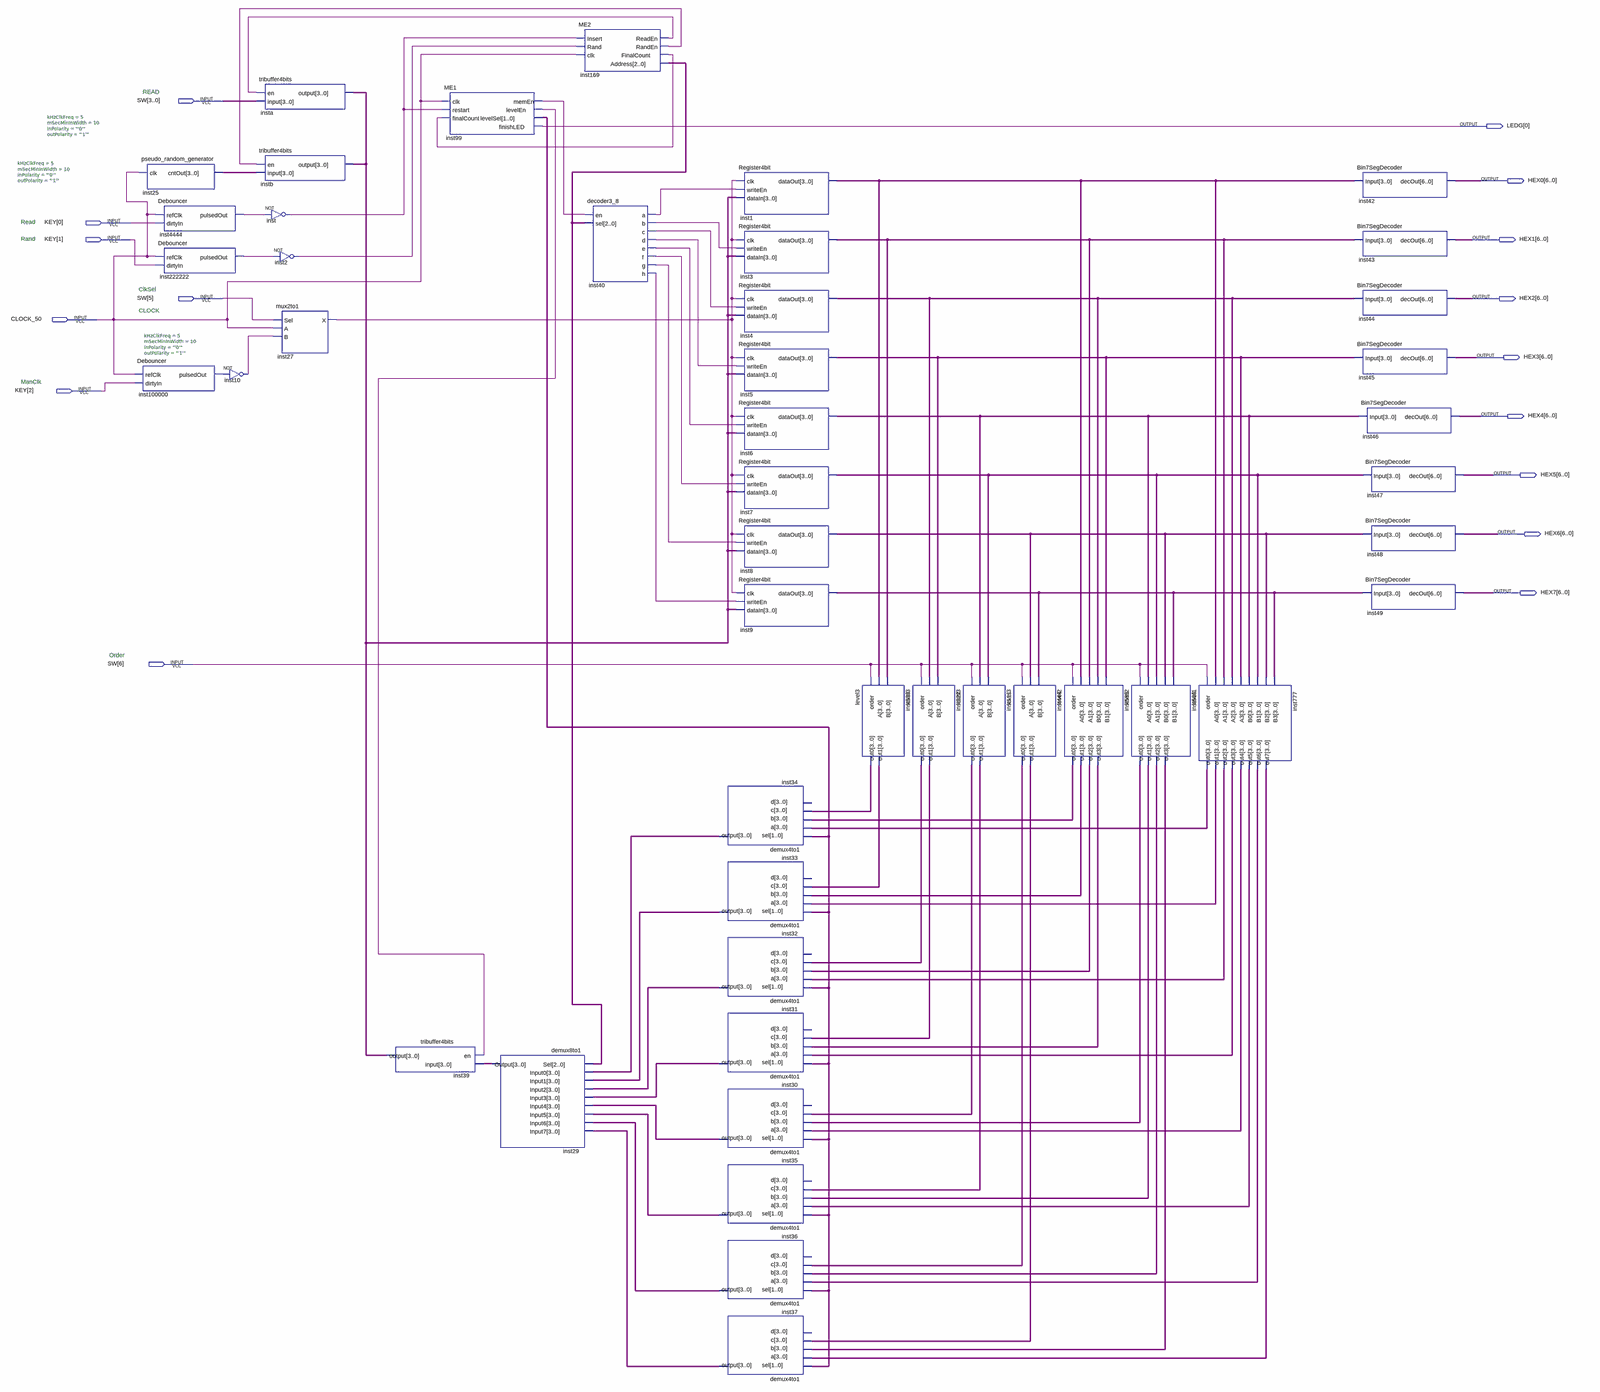
[diagram p0: schematic sheet, whole]
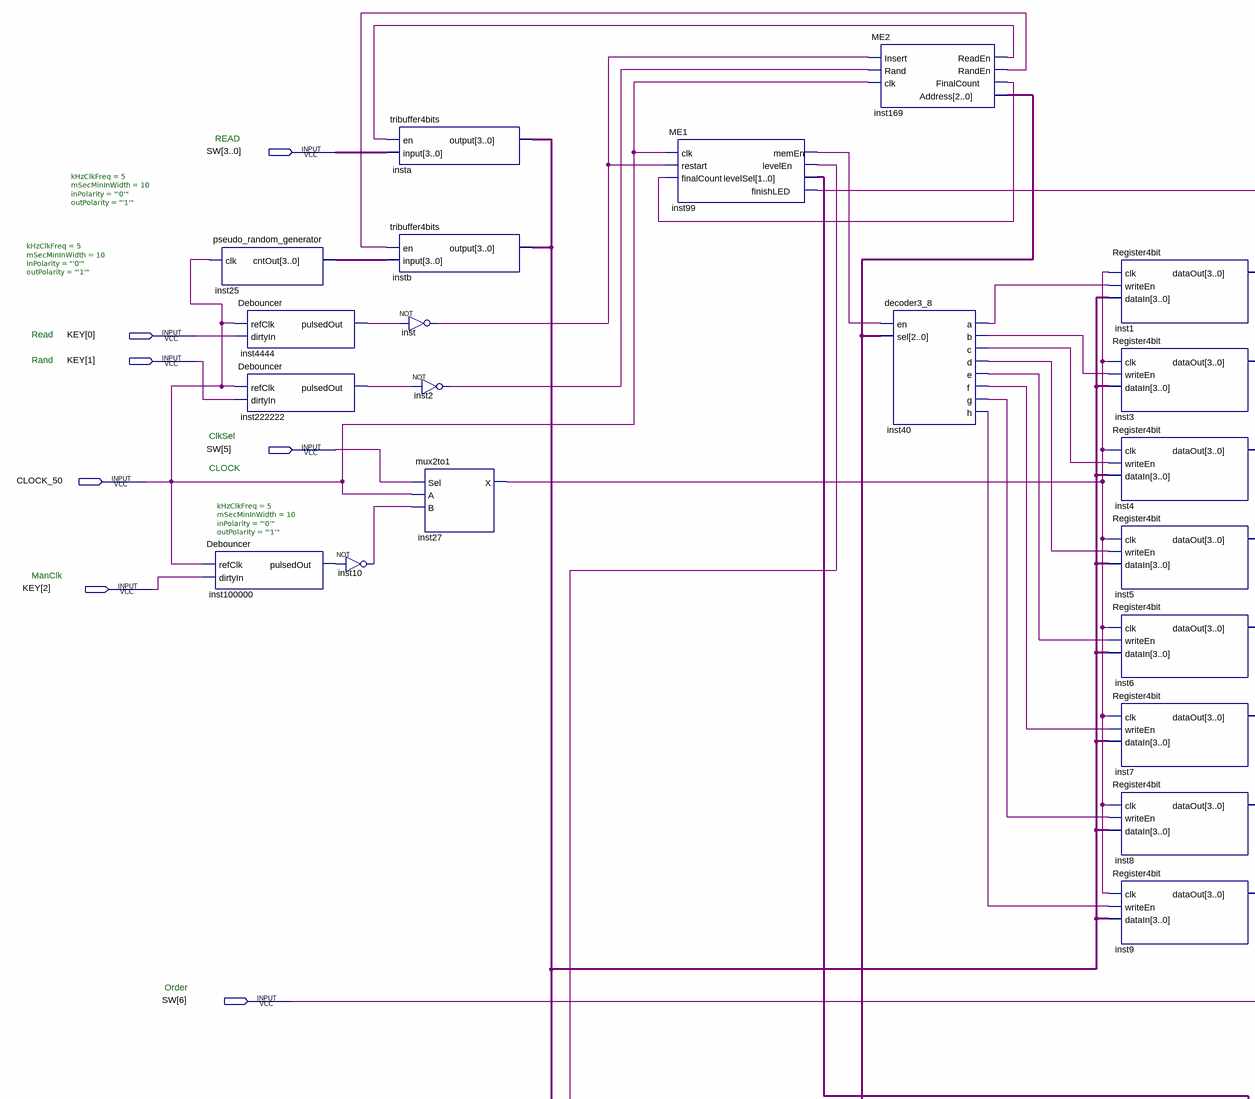
[diagram p1: schematic sheet, upper left part]
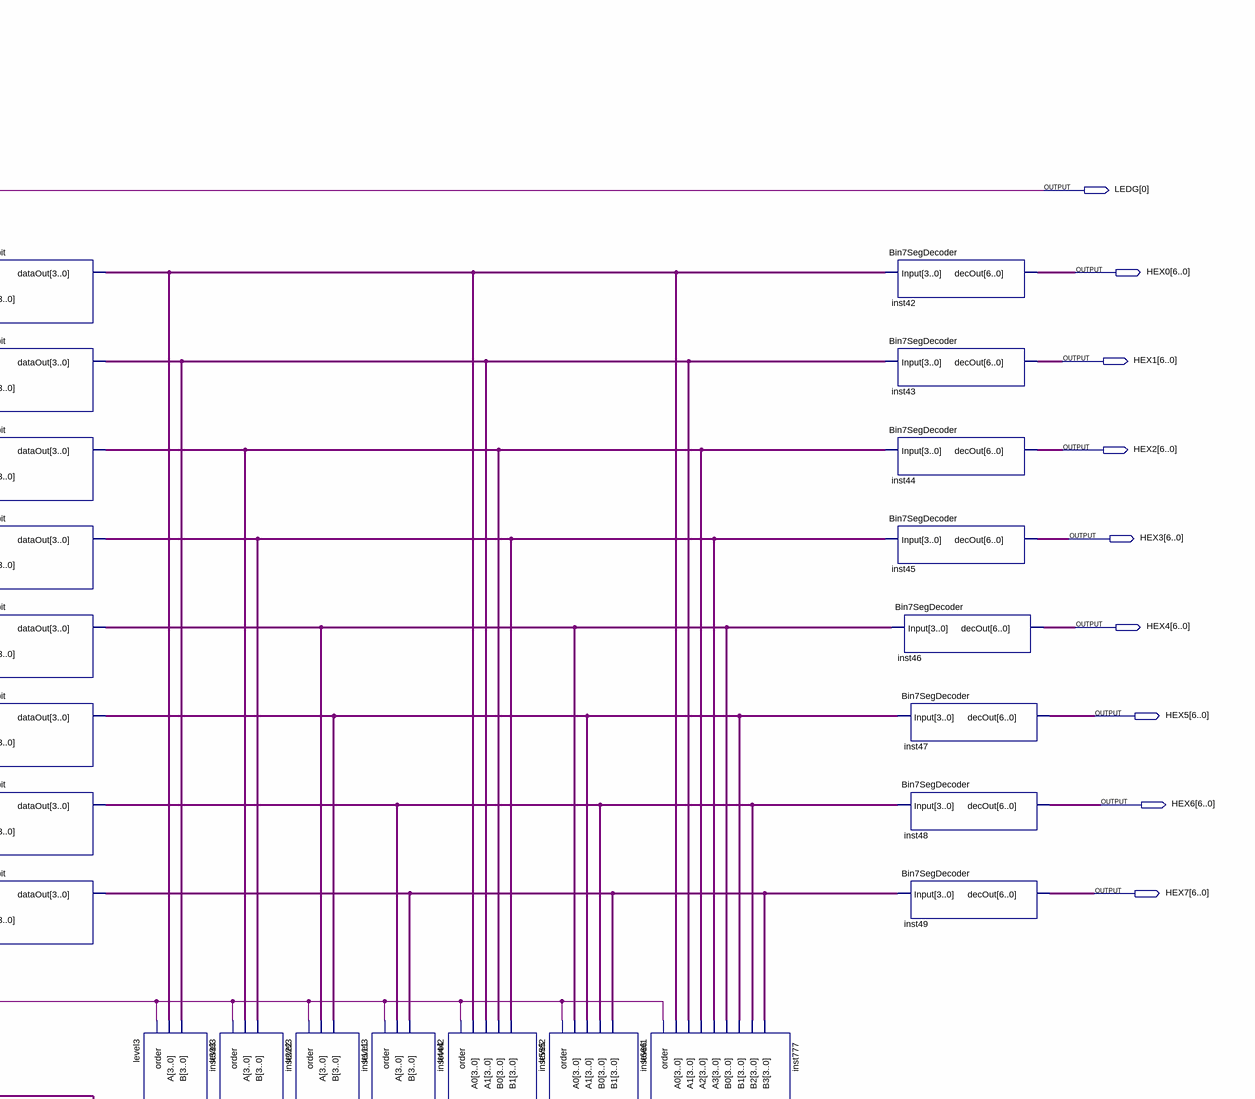
[diagram p2: schematic sheet, upper right part]
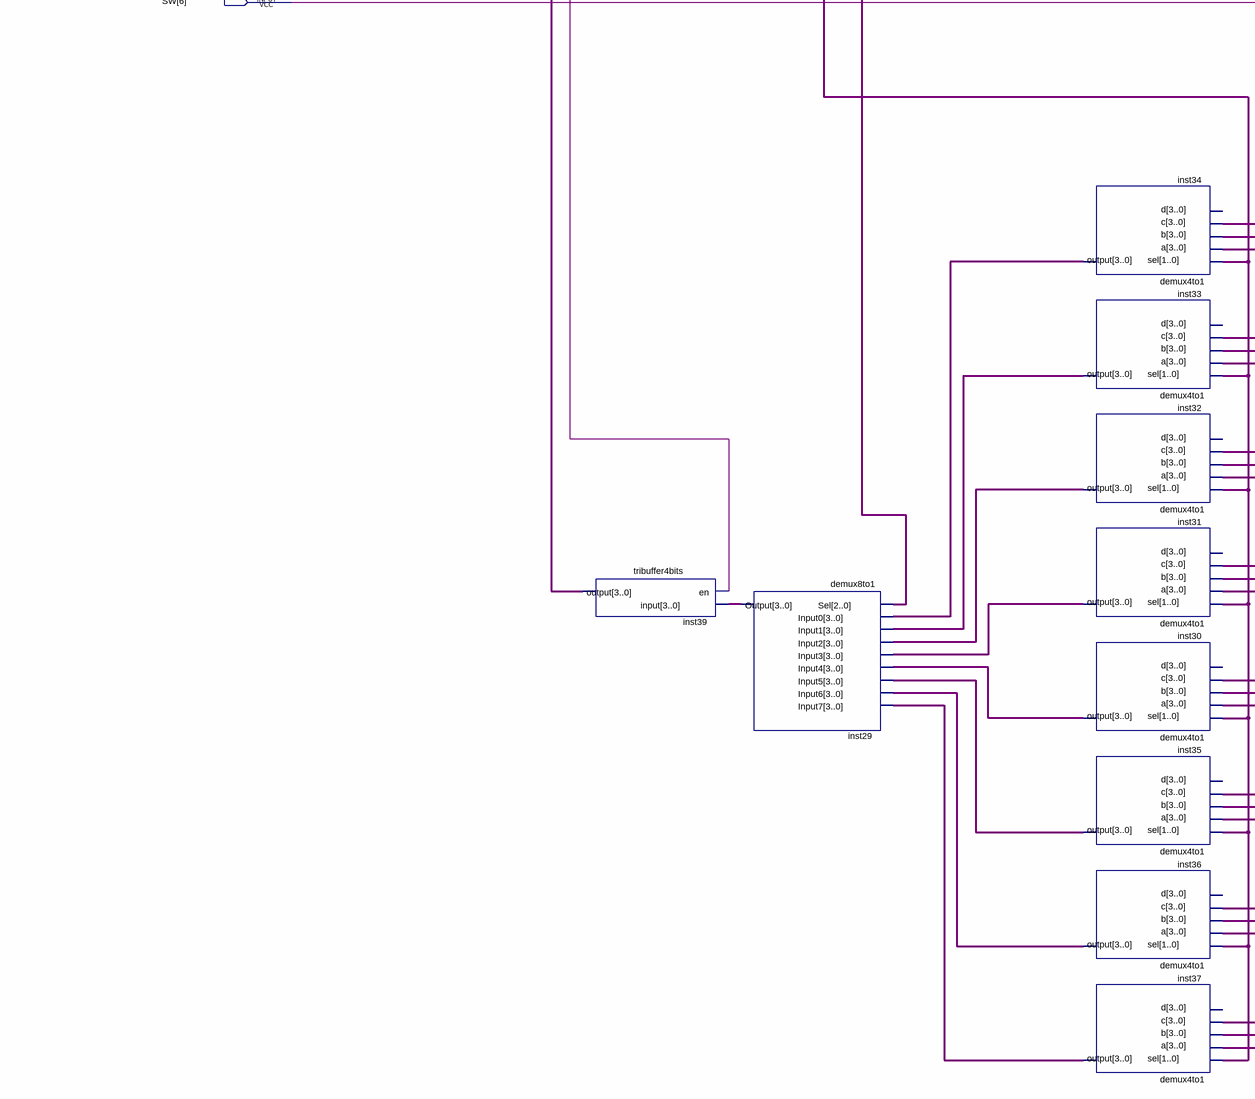
[diagram p3: schematic sheet, lower left part]
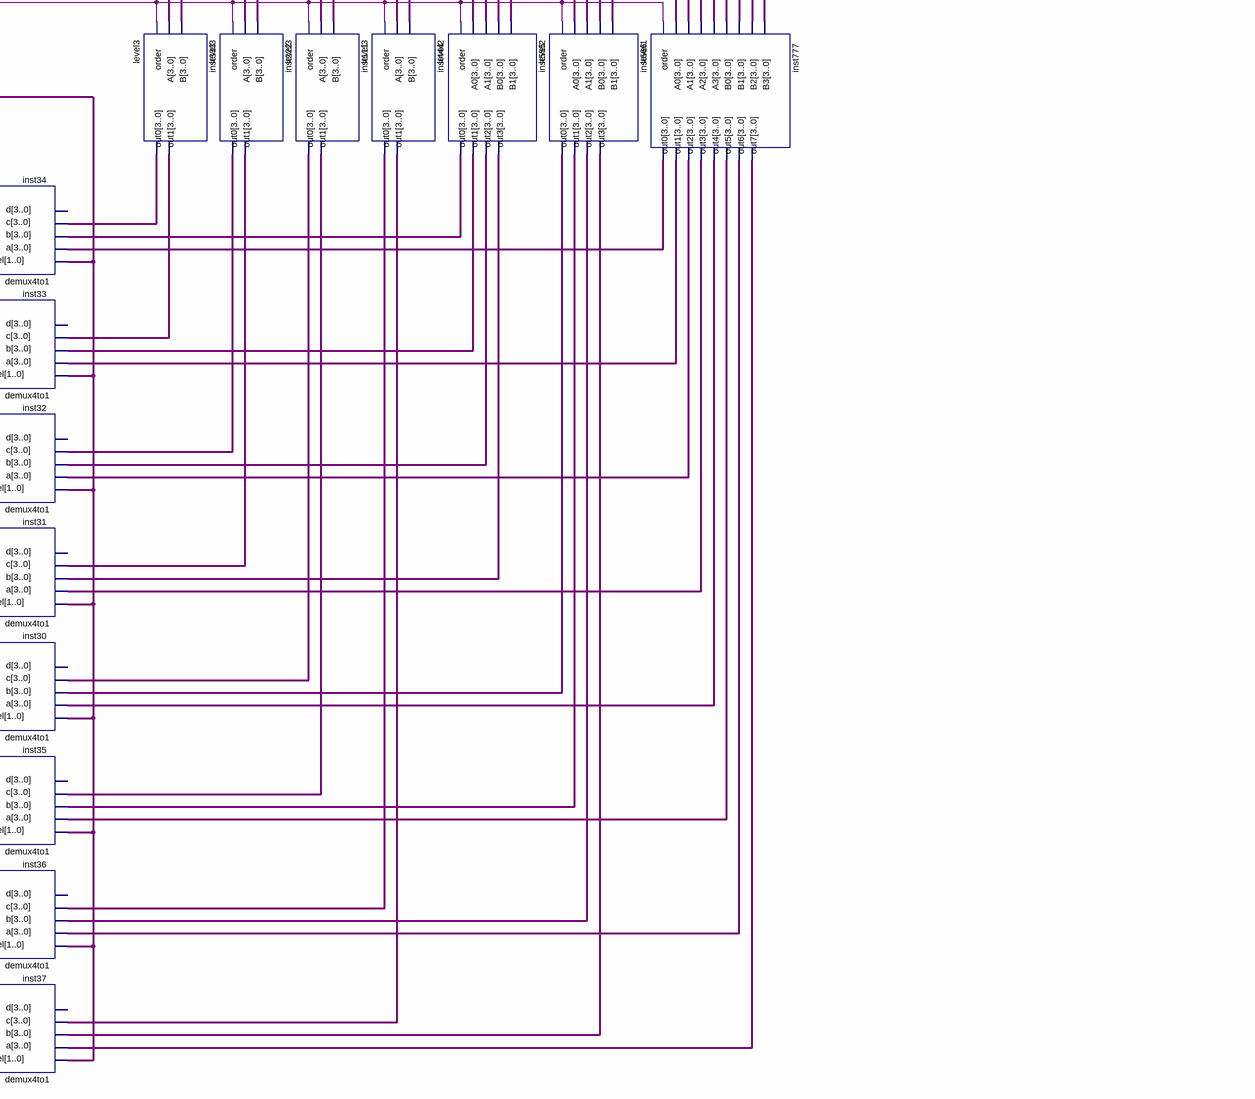
[diagram p4: schematic sheet, lower right part]
// Quartus schematic MergeSort.bdf as structural Verilog: 46 symbols, 16 pins
module MergeSort (
  input  [6:0] SW,
  input  [2:0] KEY,
  input  CLOCK_50,
  output [0:0] LEDG,
  output [6:0] HEX0,
  output [6:0] HEX1,
  output [6:0] HEX2,
  output [6:0] HEX3,
  output [6:0] HEX4,
  output [6:0] HEX5,
  output [6:0] HEX6,
  output [6:0] HEX7
);

  wire inst2_out, inst10_out, inst27_x, inst40_a, inst40_b, inst40_c, inst40_d, inst40_e, inst40_f, inst40_g,
       inst40_h, inst99_levelen, inst99_memen, inst169_finalcount, inst169_randen, inst169_readen,
       inst4444_pulsedout, inst100000_pulsedout, inst222222_pulsedout, inst_out;
  wire [1:0] inst99_levelsel;
  wire [2:0] inst169_address;
  wire [3:0] inst1_dataout, inst3_dataout, inst4_dataout, inst5_dataout, inst6_dataout, inst7_dataout,
       inst8_dataout, inst9_dataout, inst25_cntout, inst29_output, inst30_output, inst31_output,
       inst32_output, inst33_output, inst34_output, inst35_output, inst36_output, inst37_output,
       inst111_out0, inst111_out1, inst222_out0, inst222_out1, inst333_out0, inst333_out1, inst444_out0,
       inst444_out1, inst555_out0, inst555_out1, inst555_out2, inst555_out3, inst666_out0, inst666_out1,
       inst666_out2, inst666_out3, inst777_out0, inst777_out1, inst777_out2, inst777_out3, inst777_out4,
       inst777_out5, inst777_out6, inst777_out7, insta_output;

  pseudo_random_generator inst25 (.clk(CLOCK_50), .cntOut(inst25_cntout));
  Debouncer #(.kHzClkFreq(5), .mSecMinInWidth(10), .inPolarity("'0'"), .outPolarity("'1'")) inst100000 (
    .refClk(CLOCK_50), .dirtyIn(KEY[2]), .pulsedOut(inst100000_pulsedout));
  Debouncer #(.kHzClkFreq(5), .mSecMinInWidth(10), .inPolarity("'0'"), .outPolarity("'1'")) inst4444 (
    .refClk(CLOCK_50), .dirtyIn(KEY[0]), .pulsedOut(inst4444_pulsedout));
  Debouncer #(.kHzClkFreq(5), .mSecMinInWidth(10), .inPolarity("'0'"), .outPolarity("'1'")) inst222222 (
    .refClk(CLOCK_50), .dirtyIn(KEY[1]), .pulsedOut(inst222222_pulsedout));
  not inst10 (inst10_out, inst100000_pulsedout);
  tribuffer4bits insta (.en(inst169_readen), .\input (SW[3:0]), .\output (insta_output));
  tribuffer4bits instb (.en(inst169_randen), .\input (inst25_cntout), .\output (insta_output));
  not inst (inst_out, inst4444_pulsedout);
  not inst2 (inst2_out, inst222222_pulsedout);
  mux2to1 inst27 (.Sel(SW[5]), .A(CLOCK_50), .B(inst10_out), .X(inst27_x));
  tribuffer4bits inst39 (.en(inst99_levelen), .\input (inst29_output), .\output (insta_output));
  ME1 inst99 (
    .clk(CLOCK_50), .restart(inst_out), .finalCount(inst169_finalcount), .memEn(inst99_memen),
    .levelEn(inst99_levelen), .levelSel(inst99_levelsel), .finishLED(LEDG[0]));
  demux8to1 inst29 (
    .Sel(inst169_address), .Input0(inst34_output), .Input1(inst33_output), .Input2(inst32_output),
    .Input3(inst31_output), .Input4(inst30_output), .Input5(inst35_output), .Input6(inst36_output),
    .Input7(inst37_output), .Output(inst29_output));
  ME2 inst169 (
    .Insert(inst_out), .Rand(inst2_out), .clk(CLOCK_50), .ReadEn(inst169_readen), .RandEn(inst169_randen),
    .FinalCount(inst169_finalcount), .Address(inst169_address));
  decoder3_8 inst40 (
    .en(inst99_memen), .sel(inst169_address), .a(inst40_a), .b(inst40_b), .c(inst40_c), .d(inst40_d),
    .e(inst40_e), .f(inst40_f), .g(inst40_g), .h(inst40_h));
  Register4bit inst1 (.clk(inst27_x), .writeEn(inst40_a), .dataIn(insta_output), .dataOut(inst1_dataout));
  Register4bit inst3 (.clk(inst27_x), .writeEn(inst40_b), .dataIn(insta_output), .dataOut(inst3_dataout));
  Register4bit inst4 (.clk(inst27_x), .writeEn(inst40_c), .dataIn(insta_output), .dataOut(inst4_dataout));
  Register4bit inst5 (.clk(inst27_x), .writeEn(inst40_d), .dataIn(insta_output), .dataOut(inst5_dataout));
  Register4bit inst6 (.clk(inst27_x), .writeEn(inst40_e), .dataIn(insta_output), .dataOut(inst6_dataout));
  Register4bit inst7 (.clk(inst27_x), .writeEn(inst40_f), .dataIn(insta_output), .dataOut(inst7_dataout));
  Register4bit inst8 (.clk(inst27_x), .writeEn(inst40_g), .dataIn(insta_output), .dataOut(inst8_dataout));
  Register4bit inst9 (.clk(inst27_x), .writeEn(inst40_h), .dataIn(insta_output), .dataOut(inst9_dataout));
  demux4to1 inst34 (
    .sel(inst99_levelsel), .a(inst777_out0), .b(inst555_out0), .c(inst333_out0), .\output (inst34_output));  // open: d
  demux4to1 inst33 (
    .sel(inst99_levelsel), .a(inst777_out1), .b(inst555_out1), .c(inst333_out1), .\output (inst33_output));  // open: d
  demux4to1 inst32 (
    .sel(inst99_levelsel), .a(inst777_out2), .b(inst555_out2), .c(inst222_out0), .\output (inst32_output));  // open: d
  demux4to1 inst31 (
    .sel(inst99_levelsel), .a(inst777_out3), .b(inst555_out3), .c(inst222_out1), .\output (inst31_output));  // open: d
  demux4to1 inst30 (
    .sel(inst99_levelsel), .a(inst777_out4), .b(inst666_out0), .c(inst111_out0), .\output (inst30_output));  // open: d
  demux4to1 inst35 (
    .sel(inst99_levelsel), .a(inst777_out5), .b(inst666_out1), .c(inst111_out1), .\output (inst35_output));  // open: d
  demux4to1 inst36 (
    .sel(inst99_levelsel), .a(inst777_out6), .b(inst666_out2), .c(inst444_out0), .\output (inst36_output));  // open: d
  demux4to1 inst37 (
    .sel(inst99_levelsel), .a(inst777_out7), .b(inst666_out3), .c(inst444_out1), .\output (inst37_output));  // open: d
  level3 inst333 (.order(SW[6]), .A(inst1_dataout), .B(inst3_dataout), .out0(inst333_out0), .out1(inst333_out1));
  level3 inst222 (.order(SW[6]), .A(inst4_dataout), .B(inst5_dataout), .out0(inst222_out0), .out1(inst222_out1));
  level3 inst111 (.order(SW[6]), .A(inst6_dataout), .B(inst7_dataout), .out0(inst111_out0), .out1(inst111_out1));
  level3 inst444 (.order(SW[6]), .A(inst8_dataout), .B(inst9_dataout), .out0(inst444_out0), .out1(inst444_out1));
  level2 inst555 (
    .order(SW[6]), .A0(inst1_dataout), .A1(inst3_dataout), .B0(inst4_dataout), .B1(inst5_dataout),
    .out0(inst555_out0), .out1(inst555_out1), .out2(inst555_out2), .out3(inst555_out3));
  level2 inst666 (
    .order(SW[6]), .A0(inst6_dataout), .A1(inst7_dataout), .B0(inst8_dataout), .B1(inst9_dataout),
    .out0(inst666_out0), .out1(inst666_out1), .out2(inst666_out2), .out3(inst666_out3));
  level1 inst777 (
    .order(SW[6]), .A0(inst1_dataout), .A1(inst3_dataout), .A2(inst4_dataout), .A3(inst5_dataout),
    .B0(inst6_dataout), .B1(inst7_dataout), .B2(inst8_dataout), .B3(inst9_dataout), .out0(inst777_out0),
    .out1(inst777_out1), .out2(inst777_out2), .out3(inst777_out3), .out4(inst777_out4), .out5(inst777_out5),
    .out6(inst777_out6), .out7(inst777_out7));
  Bin7SegDecoder inst42 (.Input(inst1_dataout), .decOut(HEX0));
  Bin7SegDecoder inst43 (.Input(inst3_dataout), .decOut(HEX1));
  Bin7SegDecoder inst44 (.Input(inst4_dataout), .decOut(HEX2));
  Bin7SegDecoder inst45 (.Input(inst5_dataout), .decOut(HEX3));
  Bin7SegDecoder inst46 (.Input(inst6_dataout), .decOut(HEX4));
  Bin7SegDecoder inst47 (.Input(inst7_dataout), .decOut(HEX5));
  Bin7SegDecoder inst48 (.Input(inst8_dataout), .decOut(HEX6));
  Bin7SegDecoder inst49 (.Input(inst9_dataout), .decOut(HEX7));

  // Notes on the sheet:
  //   READ
  //   Read
  //   Rand
  //   ClkSel
  //   CLOCK
  //   ManClk
  //   Order
endmodule
